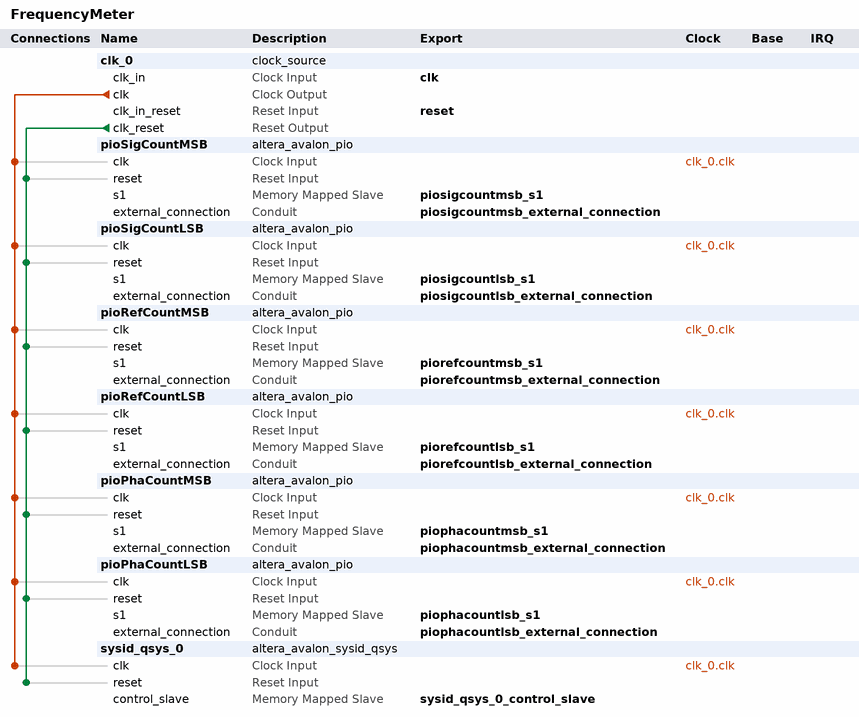
[diagram p0: system contents]
# Platform Designer (Qsys) system FrequencyMeter, Cyclone V 5CSXFC6D6F31C6
# Parameters at their usual value, and those the tool derives, are not listed.
package require -exact qsys 16.1
create_system FrequencyMeter
set_project_property DEVICE_FAMILY {Cyclone V}
set_project_property DEVICE 5CSXFC6D6F31C6

add_instance clk_0 clock_source 16.1
set_instance_parameter_value clk_0 clockFrequency 50000000

add_instance pioSigCountMSB altera_avalon_pio 16.1
set_instance_parameter_value pioSigCountMSB direction Input
set_instance_parameter_value pioSigCountMSB width 32

add_instance pioSigCountLSB altera_avalon_pio 16.1
set_instance_parameter_value pioSigCountLSB direction Input
set_instance_parameter_value pioSigCountLSB width 32

add_instance pioRefCountMSB altera_avalon_pio 16.1
set_instance_parameter_value pioRefCountMSB direction Input
set_instance_parameter_value pioRefCountMSB width 32

add_instance pioRefCountLSB altera_avalon_pio 16.1
set_instance_parameter_value pioRefCountLSB direction Input
set_instance_parameter_value pioRefCountLSB width 32

add_instance pioPhaCountMSB altera_avalon_pio 16.1
set_instance_parameter_value pioPhaCountMSB direction Input
set_instance_parameter_value pioPhaCountMSB width 32

add_instance pioPhaCountLSB altera_avalon_pio 16.1
set_instance_parameter_value pioPhaCountLSB direction Input
set_instance_parameter_value pioPhaCountLSB width 32

add_instance sysid_qsys_0 altera_avalon_sysid_qsys 16.1
set_instance_parameter_value sysid_qsys_0 id 371397237

# connections
add_connection clk_0.clk pioPhaCountLSB.clk clock
add_connection clk_0.clk pioPhaCountMSB.clk clock
add_connection clk_0.clk pioRefCountLSB.clk clock
add_connection clk_0.clk pioRefCountMSB.clk clock
add_connection clk_0.clk pioSigCountLSB.clk clock
add_connection clk_0.clk pioSigCountMSB.clk clock
add_connection clk_0.clk sysid_qsys_0.clk clock
add_connection clk_0.clk_reset pioPhaCountLSB.reset reset
add_connection clk_0.clk_reset pioPhaCountMSB.reset reset
add_connection clk_0.clk_reset pioRefCountLSB.reset reset
add_connection clk_0.clk_reset pioRefCountMSB.reset reset
add_connection clk_0.clk_reset pioSigCountLSB.reset reset
add_connection clk_0.clk_reset pioSigCountMSB.reset reset
add_connection clk_0.clk_reset sysid_qsys_0.reset reset

# exported interfaces
add_interface clk clock sink
set_interface_property clk EXPORT_OF clk_0.clk_in
add_interface piophacountlsb_external_connection conduit end
set_interface_property piophacountlsb_external_connection EXPORT_OF pioPhaCountLSB.external_connection
add_interface piophacountlsb_s1 avalon slave
set_interface_property piophacountlsb_s1 EXPORT_OF pioPhaCountLSB.s1
add_interface piophacountmsb_external_connection conduit end
set_interface_property piophacountmsb_external_connection EXPORT_OF pioPhaCountMSB.external_connection
add_interface piophacountmsb_s1 avalon slave
set_interface_property piophacountmsb_s1 EXPORT_OF pioPhaCountMSB.s1
add_interface piorefcountlsb_external_connection conduit end
set_interface_property piorefcountlsb_external_connection EXPORT_OF pioRefCountLSB.external_connection
add_interface piorefcountlsb_s1 avalon slave
set_interface_property piorefcountlsb_s1 EXPORT_OF pioRefCountLSB.s1
add_interface piorefcountmsb_external_connection conduit end
set_interface_property piorefcountmsb_external_connection EXPORT_OF pioRefCountMSB.external_connection
add_interface piorefcountmsb_s1 avalon slave
set_interface_property piorefcountmsb_s1 EXPORT_OF pioRefCountMSB.s1
add_interface piosigcountlsb_external_connection conduit end
set_interface_property piosigcountlsb_external_connection EXPORT_OF pioSigCountLSB.external_connection
add_interface piosigcountlsb_s1 avalon slave
set_interface_property piosigcountlsb_s1 EXPORT_OF pioSigCountLSB.s1
add_interface piosigcountmsb_external_connection conduit end
set_interface_property piosigcountmsb_external_connection EXPORT_OF pioSigCountMSB.external_connection
add_interface piosigcountmsb_s1 avalon slave
set_interface_property piosigcountmsb_s1 EXPORT_OF pioSigCountMSB.s1
add_interface reset reset sink
set_interface_property reset EXPORT_OF clk_0.clk_in_reset
add_interface sysid_qsys_0_control_slave avalon slave
set_interface_property sysid_qsys_0_control_slave EXPORT_OF sysid_qsys_0.control_slave

set_interconnect_requirement {$system} qsys_mm.clockCrossingAdapter HANDSHAKE
set_interconnect_requirement {$system} qsys_mm.enableEccProtection FALSE
set_interconnect_requirement {$system} qsys_mm.insertDefaultSlave FALSE
set_interconnect_requirement {$system} qsys_mm.maxAdditionalLatency 1

save_system FrequencyMeter.qsys
